# Altium schematic sheet PowerSupply.SchDoc
size A4; SheetNumber: 6; SheetTotal: 10
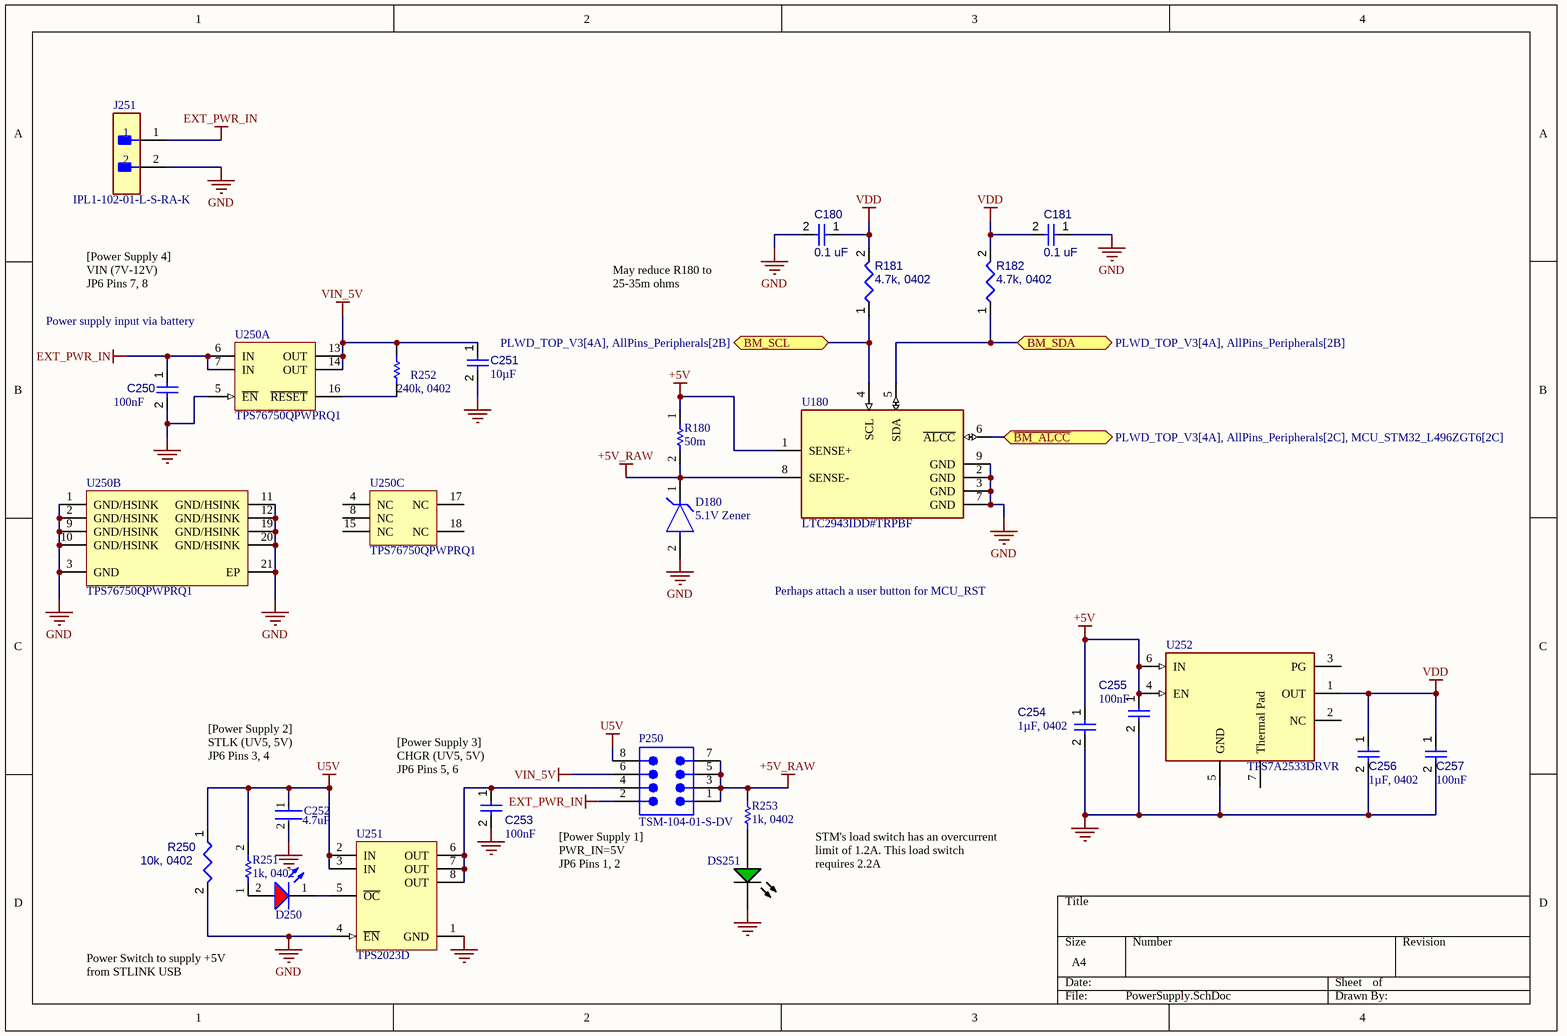
[diagram p0: PowerSupply.SchDoc]

## Parts
C180  0.1 uF  [CAPC1005X56X25LL10T15]
C181  0.1 uF  [CAPC1005X56X25LL10T15]
C250  value 100nF  [CAPC1005X56X25LL10T15]  (hidden comment: Capacitor 0.1 uF +/- 5% 16 V 0402)
C251  value 10µF  [CAPC0603(1608)100_L]  (hidden comment: Capacitor 10µF +/-20% 10V 0603)
C252  Capacitance: 4.7uF  [FP-CL282-IPC_C]  (hidden comment: CL05A475MP5NRNC)
C253  value 100nF  [CAPC1005X56X25LL10T15]  (hidden comment: Capacitor 0.1 uF +/- 5% 16 V 0402)
C254  value 1µF, 0402  [CAPC0402(1005)60_L]  (hidden comment: Capacitor 1µF +/-20% 10V 0402)
C255  value 100nF  [CAPC1005X56X25LL10T15]  (hidden comment: Capacitor 0.1 uF +/- 5% 16 V 0402)
C256  value 1µF, 0402  [CAPC0402(1005)60_L]  (hidden comment: Capacitor 1µF +/-20% 10V 0402)
C257  value 100nF  [CAPC1005X56X25LL10T15]  (hidden comment: Capacitor 0.1 uF +/- 5% 16 V 0402)
D180  5.1V Zener  [FP-SOD123-MFG]
D250  150120SS75000  [WL-SMCW_1206_150120xx75000]  (value not drawn)
DS251  LTST-C190GKT  [LTST-C190GKT_V]  (value not drawn)
J251  IPL1-102-01-L-S-RA-K  [FP-IPL1-102-01-L-S-RA-K-0]
P250  TSM-104-01-S-DV  [SMTC-TSM-104-01-X-DV]
R180  50m  [RESC1608X55X30NL15T15]
R181  4.7k, 0402  [RESC0402(1005)_L]
R182  4.7k, 0402  [RESC0402(1005)_L]
R250  10k, 0402  [RESC1005X40X25ML05T05]
R251  1k, 0402  [RESC1005X40X25ML05T05]
R252  240k, 0402  [RESC1005X40X25NL05T05]
R253  1k, 0402  [RESC1005X40X25ML05T05]
U180  LTC2943IDD#TRPBF  [FP-DD-8-05-08-1698-IPC_B]
U250  TPS76750QPWPRQ1  [PWP0020L_N]  (parts A,B,C of 3)
U251  TPS2023D  [D0008A_M]
U252  TPS7A2533DRVR  [FP-DRV0006A-IPC_C]

## Ports
BM_SCL (bidir, see PLWD_TOP_V3[4A], AllPins_Peripherals[2B]), BM_SDA (bidir, see PLWD_TOP_V3[4A], AllPins_Peripherals[2B]), ~{BM_ALCC} (bidir, see PLWD_TOP_V3[4A], AllPins_Peripherals[2C], MCU_STM32_L496ZGT6[2C])

## Nets
+5V: C254.1 C255.1 R180.1 U180.1(SENSE+) U252.4(EN) U252.6(IN)
+5V_RAW: D180.1(C) P250.1 P250.3 P250.5 P250.7 R180.2 R253.2 U180.8(SENSE-)
EXT_PWR_IN: C250.1 J251.1 P250.2 U250.6(IN) U250.7(IN)
GND: C180.2 C181.1 C250.2 C251.2 C252.2 C253.2 C254.2 C255.2 C256.2 C257.2 D180.2(A) DS251.2(K) J251.2 R250.2 U180.2(GND) U180.3(GND) U180.7(GND) U180.9(GND) U250.1(GND/HSINK) U250.2(GND/HSINK) U250.3(GND) U250.5(~{EN}) U250.9(GND/HSINK) U250.10(GND/HSINK) U250.11(GND/HSINK) U250.12(GND/HSINK) U250.19(GND/HSINK) U250.20(GND/HSINK) U250.21(EP) U251.1(GND) U251.4(~{EN}) U252.5(GND)
U5V: C252.1 P250.8 R250.1 R251.2 U251.2(IN) U251.3(IN)
VDD: C180.1 C181.2 C256.1 C257.1 R181.2 R182.2 U252.1(OUT)
VIN_5V: C251.1 P250.6 R252.2 U250.13(OUT) U250.14(OUT)
~{BM_ALCC}: U180.6(~{ALCC}) ; port ~{BM_ALCC}
BM_SCL: R181.1 U180.4(SCL) ; port BM_SCL
BM_SDA: R182.1 U180.5(SDA) ; port BM_SDA
NetC253_1: C253.1 P250.4 U251.6(OUT) U251.7(OUT) U251.8(OUT)
NetD250_1: D250.1(K) U251.5(~{OC})
NetD250_2: D250.2(A) R251.1
NetDS251_1: DS251.1(A) R253.1
NetR252_1: R252.1 U250.16(~{RESET})

Not connected (* = marked no-connect by the designer): U250 4(NC) 8(NC) 15(NC) 17(NC) 18(NC); U252 2(NC) 3(PG) 7(Thermal_Pad)

## Notes on the sheet
- [Power Supply 4]
  VIN (7V-12V)
  JP6 Pins 7, 8
- May reduce R180 to 25-35m ohms
- (near U250) Power supply input via battery
- Perhaps attach a user button for MCU_RST
- (near C252) [Power Supply 2]
  STLK (UV5, 5V)
  JP6 Pins 3, 4
- (near C253) [Power Supply 3]
  CHGR (UV5, 5V)
  JP6 Pins 5, 6
- (near P250) [Power Supply 1]
  PWR_IN=5V
  JP6 Pins 1, 2
- STM's load switch has an overcurrent limit of 1.2A. This load switch requires 2.2A
- Power Switch to supply +5V from STLINK USB

## Library data of the parts
C180 C181 = CMP-001-00001-6: Chip Capacitor, 0.1 uF, +/- 5%, 16 V, 0402 (1005 Metric); Value: 100nF; Capacitor Type: Ceramic; Voltage Rating: 16V; Min Operating Temperature: -55°C; Pins: 2; Case/Package: 0402; Max Operating Temperature: 125°C; Mounting Technology: SM; RoHS Compliant: True; Tolerance: 5%
C250 C253 C255 C257 = CMP-001-00001-6: Chip Capacitor, 0.1 uF, +/- 5%, 16 V, 0402 (1005 Metric); Capacitor Type: Ceramic; Voltage Rating: 16V; Max Operating Temperature: 125°C; Min Operating Temperature: -55°C; Case/Package: 0402; Mounting Technology: SM; Pins: 2; Tolerance: 5%; RoHS Compliant: True
C251 = CMP-001-00075-4: Chip Capacitor, 10µF +/-20%, 10V, 0603, Thickness 1 mm; Tolerance: 10%; Voltage Rating: 10V; Max Operating Temperature: 85°C; Pins: 2; Case/Package: 0603; Mounting Technology: SMT; Min Operating Temperature: -55°C
C252 = CMP-13271-000548-1: Cap Ceramic 4.7uF 10V X5R ±20% SMD 0402 +85°C Paper T/R; Max Operating Temperature: 85°C; Lead Free: Lead Free; Tolerance: 20%; Voltage Rating: 10V; Dielectric: X5R; Width: 0.02inch; Length: 0.039inch; Case/Package: 0402; Min Operating Temperature: -55°C; Packaging: Tape and Reel; Thickness: 0.022inch; Case Code (Imperial): 0402; Package Quantity: 10000; Case Code (Metric): 1005; Mount: Surface Mount
C254 C256 = CMP-001-00063-3: Chip Capacitor, 1µF +/-20%, 10V, 0402, Thickness 0.6 mm; Tolerance: 10%; Mounting Technology: SMT; Max Operating Temperature: 85°C; Voltage Rating: 10V; Pins: 2; Case/Package: 0402; Min Operating Temperature: -55°C
D180 = CMP-2000-05976-2: DIODE ZENER 5.1V 500MW SOD123; Manufacturer Part Number: BZT52C5V1-7-F; Manufacturer: Diodes Incorporated; Standoff Height: 0mm; Max Reverse Leakage Current: 2uA; Forward Current: 10mA; Power Dissipation: 370mW; Max Zener Voltage: 5.4V; Zener Impedance: 60Ω; Automotive Grade: NA; Max Junction Temp: +150°C; Device Class L3: Zener Diodes; ComponentLink2Description: Datasheet; Mouser Description: Zener Diodes 5.1V 500mW; Octopart: https://octopart.com/bzt52c5v1-7-f-diodes+inc.-326718; Package: SOD123; RoHS: TRUE; Nom Zener Voltage: 5.1V; Device Class L1: Discrete Semiconductors; Lead Free: Yes; Footprint Url: https://www.diodes.com/assets/Package-Files/SOD123.pdf; ComponentLink2URL: https://www.diodes.com/assets/Datasheets/ds18004.pdf; Digikey Description: DIODE ZENER 5.1V 500MW SOD123; Height: 1.45mm; Temperature Range Low: -65°C; Device Class L2: Diodes; Temperature: -65°C to +150°C; Automotive: No; Temperature Range High: +150°C; Category: Diode
D250 = CMP-1426-00017-2: NexarPartId: 29717789; Luminous Intensity: 60mcd; Viewing Angle: 140°; Test Current: 20mA; Lens Style: Clear, Rectangular; Wavelength: 630nm; Max Reverse Voltage (DC): 5V; Color: Red; Forward Current: 100mA; Peak Wavelength: 645nm; Forward Voltage: 1.9V; Case Code (Imperial): 1206; Mount: Surface Mount; Height: 680µm; RoHS: Compliant; REACH SVHC: Unknown; Case Code (Metric): 3216; Width: 1.6mm; Dominant Wavelength: 630nm; Packaging: Tape and Reel; Min Operating Temperature: -40°C; Max Operating Temperature: 85°C; Case/Package: 1206; Length: 3.2mm
DS251 = CMP-007-00022-2: LED Uni-Color Green, 100 mW, 30 mA, -55 to 85 degC, 2-Pin SMD, RoHS, Tape and Reel; Manufacturer: Lite-On; Power: 100mW; Forward Voltage: 2.1V; Viewing Angle: 130degrees; Forward Current: 20mA; Luminous Intensity: 6mcd; Lens Style: Clear; Manufacturer URL: http://www.us.liteon.com/; RoHS Compliant: True; Colour: Green; Package Description: 2-Pin Surface Mount Device, Body 1.6 x 0.8 mm; Datasheet URL: http://datasheet.octopart.com/LTST-C190GKT-Lite-On-datasheet-158530.pdf; Datasheet Version: Dec-06; Mounting Technology: SM; Case/Package: 0603; Package Reference: C190GKT; Packaging: TapeandReel; Min Operating Temperature: -55°C; Nominal Vf: 2.1V; Package Quantity: 3000; Illumination Colour: Green; Max Operating Temperature: 85°C; Pins: 2
J251 = CMP-02766-000264-1: 2 Position 1 Row .100" (2.54 mm) pitch connector; Number of Terminals/Pins: 2; Number of Ports: 1; Gender: Male; Max Current Rating: 7.4A; Connector Type: Male Pin; Max Voltage Rating (AC): 675V; Pitch: 2.54mm; Min Operating Temperature: -55°C; Number of Contacts: 2; Contact Plating: Gold; REACH SVHC: No SVHC; Packaging: Rail/Tube; Termination: Solder; Length: 6.6mm; Radiation Hardening: No; Contact Material: Bronze; Package Quantity: 1; Contact Mating Length: 0.215inch; Number of Positions: 2; Max Operating Temperature: 125°C; Orientation: Right Angle; Number of Rows: 1; Housing Material: Polymer; Depth: 9.65mm; Fastening Type: Ramp; Mount: Through Hole; Lead Free: Lead Free; Color: Natural
P250 = CMP-1024-00218-1: 0.025" SQ Post Header, Surface Mount, Vertical, -55 to 125 degC, 2.54 mm Pitch, 8-Pin, Male, RoHS; Manufacturer: Samtec; Pitch: 2.54 mm; ComponentLink3URL: http://www.samtec.com/documents/webfiles/cpdf/TSM-1XX-XX-XXX-XX-X-XXX-X-MKT.pdf; ComponentLink1URL: http://www.samtec.com; PackageDescription: Double Row Gullwing ASM; ComponentLink3Description: Package Specification; PackageVersion: DJ, 4/1991; ComponentLink1Description: Manufacturer URL; Orientation: Vertical; Temperature Range: -55 to 125 degC; PartNumber: TSM-104-01-S-DV; ComponentLink2Description: Datasheet; RoHS: True; Mounting Technology: Surface Mount; ComponentLink2URL: http://www.samtec.com/documents/webfiles/pdf/TSM.PDF; PackageReference: TSM-104-01-X-DV; DatasheetVersion: F-214
R180 = CMP-2000-00867-1: Manufacturer: Panasonic; Part Number: ERJ-L03KF50MV
R181 R182 = CMP-009-00158-3: Chip Resistor, 4,7 kOhms, +/-1 %, 63 mW, -55 to 155 degC, 0402; Power: 63mW; Tolerance: 1%; Max Operating Temperature: 155°C; Pins: 2; Value: 4.7k; Min Operating Temperature: -55°C; Case/Package: 0402
R250 = CMP-009-00015-5: Chip Resistor, 10 KOhm, +/- 1%, 0.1 W, -55 to 155 degC, 0402 (1005 Metric); Voltage Rating: 50V; Power: 100mW; Case/Package: 0402; Value: 10k; RoHS Compliant: True; Min Operating Temperature: -55°C; Mounting Technology: SM; Tolerance: 1%; Max Operating Temperature: 155°C; Pins: 2
R251 R253 = CMP-009-00009-5: Chip Resistor, 1 KOhm, +/- 1%, 0.1 W, -55 to 155 degC, 0402 (1005 Metric); Power: 100mW; Voltage Rating: 50V; Min Operating Temperature: -55°C; Max Operating Temperature: 155°C; RoHS Compliant: True; Mounting Technology: SM; Pins: 2; Tolerance: 1%; Case/Package: 0402; Value: 1k
R252 = CMP-2002-00799-3: Chip Resistor, 240 KOhm, +/- 1%, 100 mW, -55 to 155 degC, 0402 (1005 Metric), RoHS, Tape and Reel; Manufacturer: Basic Passives; PartNumber: ERJ-2RKF2403X; Power Rating: 100 mW; Voltage Rating: 50 V; Case\/Package: 0402; DatasheetVersion: 04/2015; RoHSCompliant: true; Resistance: 240 KOhm; Mounting Technology: Surface Mount; Case Code (Imperial): 0402; Height: 0.35 mm; Max Operating Temperature: 155 degC; PackageReference: 0402; ComponentLink1Description: Manufacturer URL; Min Operating Temperature: -55 degC; Package Quantity: 10000; Mount: Surface Mount; Radiation Hardening: No; Case Code (Metric): 1005; Packaging: Tape and Reel; Length: 1 mm; ComponentLink1URL: http://www.panasonic.com/; REACH SVHC: Unknown; Tolerance: 1%; Width: 0.5 mm; PackageDescription: 2-Pin Surface Mount Device, Body 1 x 0.5 mm; Pins: 2; ComponentLink2URL: http://industrial.panasonic.com/cdbs/www-data/pdf/RDA0000/AOA0000C86.pdf; ComponentLink2Description: Datasheet
U180 = CMP-09132-000025-1: IC BATT MONITOR MULTI-CHEM 8DFN; Interface: I2C; Case/Package: DFN; Packaging: Tape and Reel; Number of Pins: 8; Max Operating Temperature: 85°C; RoHS Compliant: Yes; Min Operating Temperature: -40°C
U250 = CMP-0395-01233-2: Single Output Automotive LDO, 1 A, Fixed 5 V Output, 2.7 to 10 V Input, 20-pin HTSSOP (PWP), -40 to 125 degC, Green (RoHS & no Sb/Br); Manufacturer: Texas Instruments; SubFamily: Single Channel LDO; Iout(Max)(A): 1; Vdo(Typ)(mV): 230; Fixed Output Options(V): 5; Vin(Max)(V): 10; Vin(Min)(V): 2.7; Accuracy(%): 2; Iq(Typ)(mA): 0.08; Eco-Plan: Green (RoHS & no Sb/Br); Code_JEDEC: MO-153; PackageVersion: 4073225-4/I; PartNumber: TPS76750QPWPRQ1; DatasheetVersion: SGLS009B; Mounting Technology: Surface Mount; Vout Adj(Max)(V): 5; ComponentLink3URL: http://www.ti.com/litv/pdf/mhts001g; Vout Adj(Min)(V): 5; ComponentLink3Description: Package Specification; ComponentLink1URL: http://www.ti.com/; ComponentLink1Description: Manufacturer URL; PackageReference: PWP0020L; ComponentLink2URL: http://www.ti.com/general/docs/lit/getliterature.tsp?genericPartNumber=TPS76750-Q1&fileType=pdf; ComponentLink2Description: Datasheet; PackageDescription: 20-Pin Plastic Small Outline, Body 4.4 x 6.5 mm, Pitch 0.65 mm
U251 = CMP-0337-00189-2: 1.65 A, 2.7 to 5.5 V Single Power Distribution Switch IC Hi-Side MOSFET, Fault Report, 33 mOhms rDS(On), -40 to 85 degC, 8-pin SOIC (D), Green (RoHS & no Sb/Br); Manufacturer: Texas Instruments; Continuous Current(Max)(A): 1.5; Enable: Active Low; Number of Switches: 1; Current Limit(A): 2.2; Vin(Max)(V): 5.5; Vin(Min)(V): 2.7; rDS(on) per FET(Typ)(mOhms): 33; Rating: Catalog; Eco-Plan: Green (RoHS & no Sb/Br); PartNumber: TPS2023D; PackageVersion: revM, Jun-2011; ComponentLink1URL: http://www.ti.com/general/docs/lit/getliterature.tsp?genericPartNumber=TPS2023&fileType=pdf; Code_JEDEC: MS-012AA; DatasheetVersion: SLVS175C; ComponentLink1Description: Datasheet; Mounting Technology: Surface Mount; PackageDescription: 8-Pin Plastic Small Outline Integrated Circuit, 4.9 x 3.9 mm, Pitch 1.27 mm Pitch; PackageReference: D0008A
U252 = CMP-04917-000317-1: IC REG LINEAR 3.3V 300MA 6WSON